# EAGLE schematic MQTTAmpSwitch (EAGLE 6.5.0)
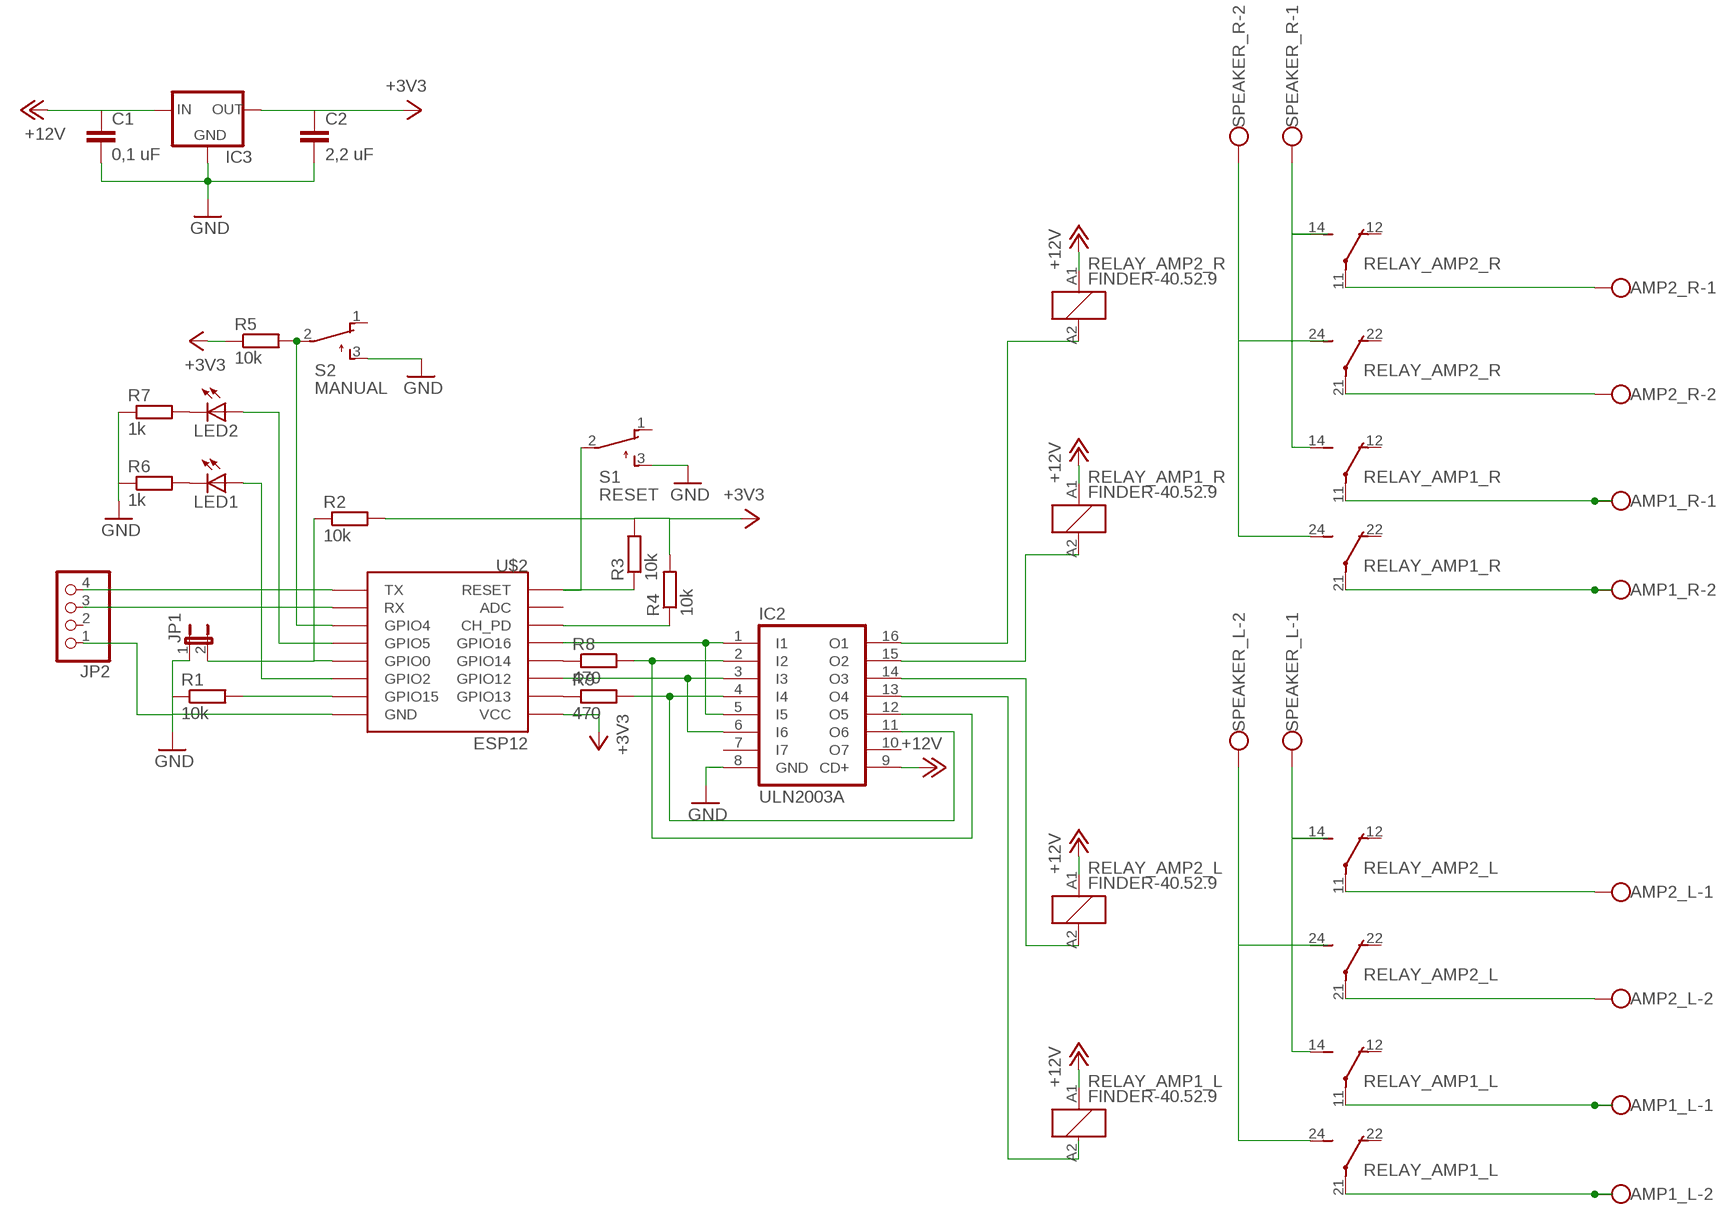
[diagram p0: schematic, sheet 1]

## Parts
AMP1_L  W239-302  [W239-302]
AMP1_R  W239-302  [W239-302]
AMP2_L  W239-302  [W239-302]
AMP2_R  W239-302  [W239-302]
C1  0,1 uF  C2,5-3  [C2.5-3]
C2  2,2 uF  C2,5-3  [C2.5-3]
IC2  ULN2003A  ULN2003AN  [DIL16]
IC3  78XXS  [78XXS]
JP1  JP1E  [JP1]
JP2  PINHD-1X4  [1X04]
LED1  LED5MM  [LED5MM]
LED2  LED5MM  [LED5MM]
R1  10k  R-EU_0204/7  [0204/7]
R2  10k  R-EU_0204/7  [0204/7]
R3  10k  R-EU_0204/7  [0204/7]
R4  10k  R-EU_0204/7  [0204/7]
R5  10k  R-EU_0204/7  [0204/7]
R6  1k  R-EU_0204/7  [0204/7]
R7  1k  R-EU_0204/7  [0204/7]
R8  470  R-EU_0204/7  [0204/7]
R9  470  R-EU_0204/7  [0204/7]
RELAY_AMP1_L  FINDER-40.52.9  FINDER-30.22  [FINDER-30.22]
RELAY_AMP1_R  FINDER-40.52.9  FINDER-30.22  [FINDER-30.22]
RELAY_AMP2_L  FINDER-40.52.9  FINDER-30.22  [FINDER-30.22]
RELAY_AMP2_R  FINDER-40.52.9  FINDER-30.22  [FINDER-30.22]
S1  RESET  TL32PO  [TL3XPO]
S2  MANUAL  TL32PO  [TL3XPO]
SPEAKER_L  W239-302  [W239-302]
SPEAKER_R  W239-302  [W239-302]
U$2  ESP12  [ESP12]

## Nets
+3V3: C2.1 IC3.OUT R2.2 R3.2 R4.2 R5.1 U$2.VCC
+12V: C1.1 IC2.9(CD+) IC3.IN RELAY_AMP1_L.A1 RELAY_AMP1_R.A1 RELAY_AMP2_L.A1 RELAY_AMP2_R.A1
GND: C1.2 C2.2 IC2.8(GND) IC3.GND JP1.1 JP2.1 R1.1 R6.1 R7.1 S1.3(S) S2.3(S) U$2.GND
N$1: AMP1_R.2 RELAY_AMP1_R.21(-2:P)
N$2: AMP1_R.1 RELAY_AMP1_R.11(-1:P)
N$3: AMP1_L.2 RELAY_AMP1_L.21(-2:P)
N$4: AMP1_L.1 RELAY_AMP1_L.11(-1:P)
N$5: AMP2_R.2 RELAY_AMP2_R.21(-2:P)
N$6: AMP2_R.1 RELAY_AMP2_R.11(-1:P)
N$7: AMP2_L.2 RELAY_AMP2_L.21(-2:P)
N$8: AMP2_L.1 RELAY_AMP2_L.11(-1:P)
N$9: RELAY_AMP1_L.14(-1:S) RELAY_AMP2_L.14(-1:S)
N$10: SPEAKER_L.1
N$11: RELAY_AMP1_L.24(-2:S) SPEAKER_L.2
N$12: RELAY_AMP1_R.14(-1:S) RELAY_AMP2_R.14(-1:S)
N$13: SPEAKER_R.1
N$14: RELAY_AMP1_R.24(-2:S) SPEAKER_R.2
N$19: R8.1 U$2.GPIO14
N$20: R9.1 U$2.GPIO13
N$23: R1.2 U$2.GPIO15
N$24: JP1.2 R2.1 U$2.GPIO0
N$25: R3.1 S1.2(P) U$2.RESET
N$26: R4.1 U$2.CH_PD
N$27: JP2.4 U$2.TX
N$28: JP2.3 U$2.RX
N$29: R5.2 S2.2(P) U$2.GPIO4
N$30: IC2.1(I1) IC2.5(I5)
N$31: LED1.K(C) R6.2
N$32: LED2.K(C) R7.2
N$33: LED2.A U$2.GPIO5
N$34: LED1.A U$2.GPIO2
N$35: IC2.2(I2) IC2.12(O5) R8.2
N$36: IC2.3(I3) IC2.6(I6)
N$37: IC2.4(I4) IC2.11(O6) R9.2
N$40: IC2.13(O4)
N$41: IC2.14(O3) RELAY_AMP2_L.A2
N$42: IC2.15(O2) RELAY_AMP1_R.A2
N$43: IC2.16(O1) RELAY_AMP2_R.A2
Unconnected: IC2.7(I7) IC2.10(O7) JP2.2 RELAY_AMP1_L.12(-1:O) RELAY_AMP1_L.22(-2:O) RELAY_AMP1_L.A2 RELAY_AMP1_R.12(-1:O) RELAY_AMP1_R.22(-2:O) RELAY_AMP2_L.12(-1:O) RELAY_AMP2_L.22(-2:O) RELAY_AMP2_L.24(-2:S) RELAY_AMP2_R.12(-1:O) RELAY_AMP2_R.22(-2:O) RELAY_AMP2_R.24(-2:S) S1.1(O) S2.1(O) U$2.ADC U$2.GPIO12 U$2.GPIO16

## Library data of the parts
AMP1_L AMP1_R AMP2_L AMP2_R SPEAKER_L SPEAKER_R = con-wago-500:W239-302: WAGO SCREW CLAMP; OC_FARNELL: unknown; OC_NEWARK: unknown
C1 C2 = capacitor-wima:C: CAPACITOR naming: grid - package width
IC2 = uln-udn:ULN2003A: DRIVER ARRAY
IC3 = v-reg:78XXS: VOLTAGE REGULATOR
JP1 = jumper:JP1E: JUMPER
JP2 = pinhead:PINHD-1X4: PIN HEADER
LED1 LED2 = led:LED: LED OSRAM: - CHIPLED LG R971, LG N971, LY N971, LG Q971, LY Q971, LO R971, LY R971 LH N974, LH R974 LS Q976, LO Q976, LY Q976 LO Q996 - Hyper CHIPLED LW Q18S LB Q993, LB Q99A, LB R99A - SideLED LS A670, LO A670, LY A670, LG A670, LP A670 LB A673, LV A673, LT A673, LW A673 LH A674 LY A675 LS A676, LA A676, LO A676, LY A676, LW A676 LS A679, LY A679, LG A679 - Hyper Micro SIDELED® LS Y876, LA Y876, LO Y876, LY Y876 LT Y87S - SmartLED LW L88C, LW L88S LB L89C, LB L89S, LG L890 LS L89K, LO L89K, LY L89K LS L896, LA L896, LO L896, LY L896 - TOPLED LS T670, LO T670, LY T670, LG T670, LP T670 LSG T670, LSP T670, LSY T670, LOP T670, LYG T670 LG T671, LOG T671, LSG T671 LB T673, LV T673, LT T673, LW T673 LH T674 LS T676, LA T676, LO T676, LY T676, LB T676, LH T676, LSB T676, LW T676 LB T67C, LV T67C, LT T67C, LS T67K, LO T67K, LY T67K, LW E67C LS E67B, LA E67B, LO E67B, LY E67B, LB E67C, LV E67C, LT E67C LW T67C LS T679, LY T679, LG T679 LS T770, LO T770, LY T770, LG T770, LP T770 LB T773, LV T773, LT T773, LW T773 LH T774 LS E675, LA E675, LY E675, LS T675 LS T776, LA T776, LO T776, LY T776, LB T776 LHGB T686 LT T68C, LB T68C - Hyper Mini TOPLED® LB M676 - Mini TOPLED Santana® LG M470 LS M47K, LO M47K, LY M47K Source: http://www.osram.convergy.de LUXEON: - LUMILED® LXK2-PW12-R00, LXK2-PW12-S00, LXK2-PW14-U00, LXK2-PW14-V00 LXK2-PM12-R00, LXK2-PM12-S00, LXK2-PM14-U00 LXK2-PE12-Q00, LXK2-PE12-R00, LXK2-PE12-S00, LXK2-PE14-T00, LXK2-PE14-U00 LXK2-PB12-K00, LXK2-PB12-L00, LXK2-PB12-M00, LXK2-PB14-N00, LXK2-PB14-P00, LXK2-PB14-Q00 LXK2-PR12-L00, LXK2-PR12-M00, LXK2-PR14-Q00, LXK2-PR14-R00 LXK2-PD12-Q00, LXK2-PD12-R00, LXK2-PD12-S00 LXK2-PH12-R00, LXK2-PH12-S00 LXK2-PL12-P00, LXK2-PL12-Q00, LXK2-PL12-R00 Source: www.luxeon.com KINGBRIGHT: KA-3528ASYC Source: www.kingbright.com
R1-R9 = resistor:R-EU_: RESISTOR, European symbol
RELAY_AMP1_L RELAY_AMP1_R RELAY_AMP2_L RELAY_AMP2_R = relay:FINDER-30.22: SUBMINIATURE DIL-RELAIS FINDER 30.22.9.024.0000 Kontakt max. AC - 125V Distributor: Farnell Bestell Nr.: 1217371 Source: http://www.farnell.com/datasheets/87634.pdf; OC_FARNELL: unknown; OC_NEWARK: unknown
S1 S2 = switch:TL32PO: TINY SWITCH ON - MOM Source: http://www2.produktinfo.conrad.com/datenblaetter/700000-724999/705152-da-01-de-Subminiaturschalter_TL_36YO.pdf
U$2 = esp8266modules:ESP12: ESP8266 Wifi module 12